# Altium schematic sheet MCU.SchDoc
size A4
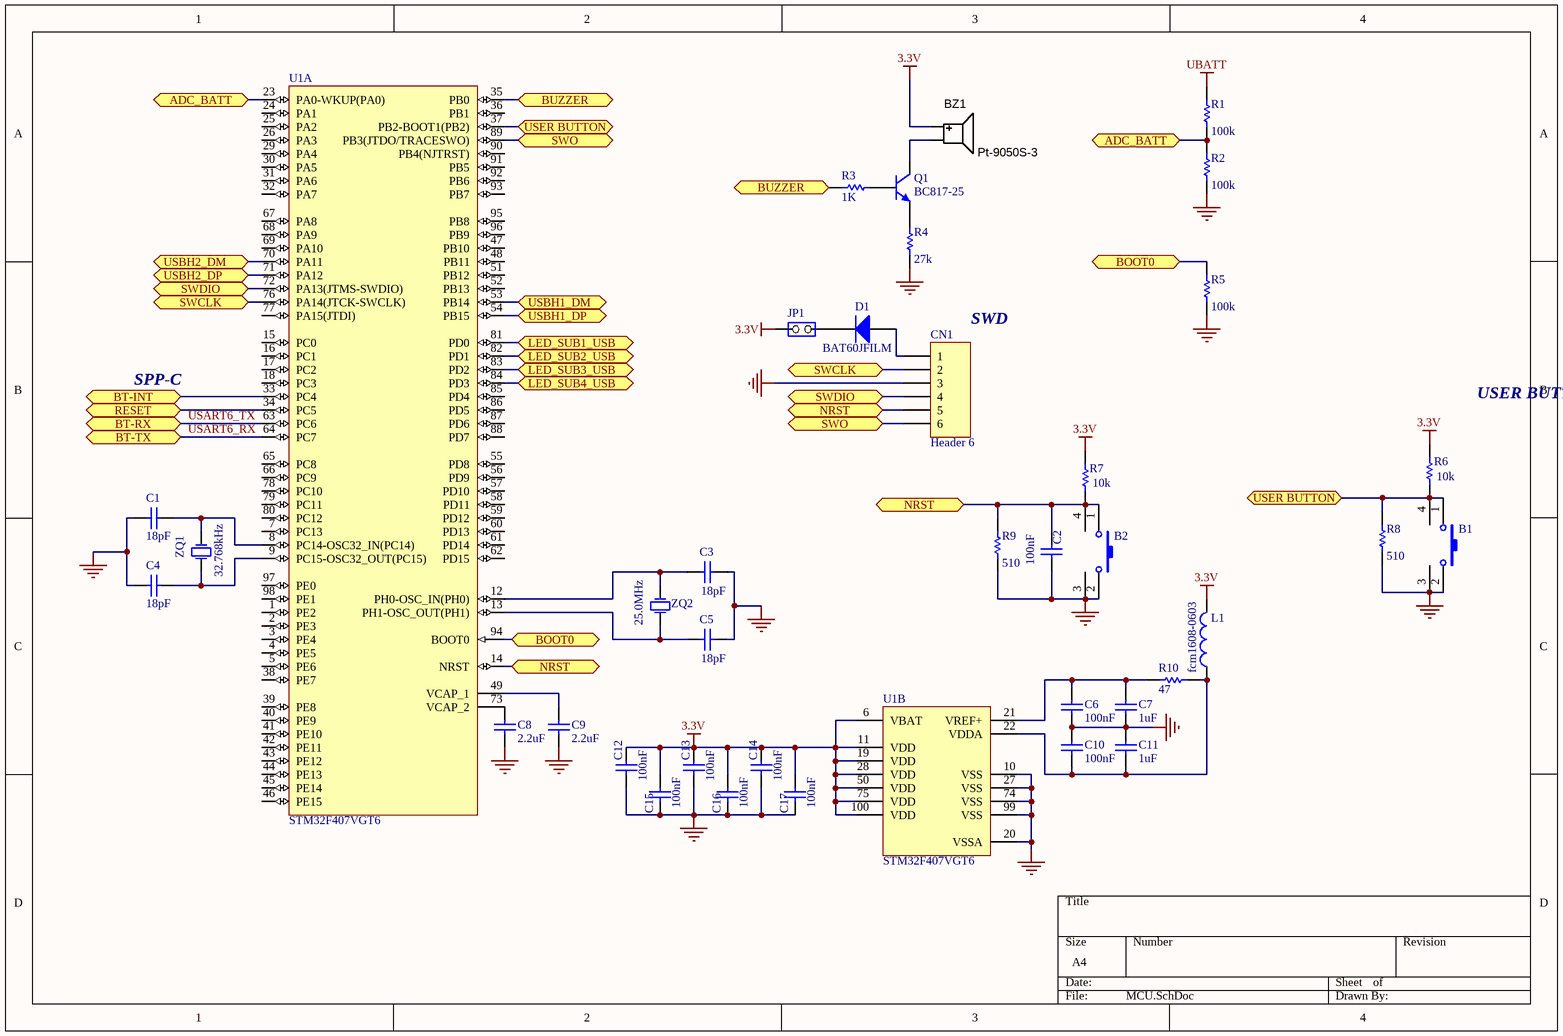
[diagram p0: MCU.SchDoc]

## Parts
B1  SW-PB  [SPST-2]  (value not drawn)
B2  SW-PB  [SPST-2]  (value not drawn)
BZ1  Pt-9050S-3  [BUZZER_12.0X8.5MM]
C1  value 18pF  [RAD-0.3]  (hidden comment: Cap)
C2  value 100nF  [RAD-0.3]  (hidden comment: Cap)
C3  value 18pF  [RAD-0.3]  (hidden comment: Cap)
C4  value 18pF  [RAD-0.3]  (hidden comment: Cap)
C5  value 18pF  [RAD-0.3]  (hidden comment: Cap)
C6  value 100nF  [RAD-0.3]  (hidden comment: Cap)
C7  value 1uF  [RAD-0.3]  (hidden comment: Cap)
C8  value 2.2uF  [RAD-0.3]  (hidden comment: Cap)
C9  value 2.2uF  [RAD-0.3]  (hidden comment: Cap)
C10  value 100nF  [RAD-0.3]  (hidden comment: Cap)
C11  value 1uF  [RAD-0.3]  (hidden comment: Cap)
C12  value 100nF  [RAD-0.3]  (hidden comment: Cap)
C13  value 100nF  [RAD-0.3]  (hidden comment: Cap)
C14  value 100nF  [RAD-0.3]  (hidden comment: Cap)
C15  value 100nF  [RAD-0.3]  (hidden comment: Cap)
C16  value 100nF  [RAD-0.3]  (hidden comment: Cap)
C17  value 100nF  [RAD-0.3]  (hidden comment: Cap)
CN1  Header 6  [HDR1X6]
D1  BAT60JFILM  [SOD323/A]
JP1  (no value)  [SIP2/2.54]
L1  value fcm1608-0603  [0402-A]  (hidden comment: Inductor)
Q1  BC817-25  [TO-226-AA]
R1  value 100k  [AXIAL-0.3]  (hidden comment: Res1)
R2  value 100k  [AXIAL-0.3]  (hidden comment: Res1)
R3  value 1K  [AXIAL-0.3]  (hidden comment: Res1)
R4  value 27k  [AXIAL-0.3]  (hidden comment: Res1)
R5  value 100k  [AXIAL-0.3]  (hidden comment: Res1)
R6  value 10k  [AXIAL-0.3]  (hidden comment: Res1)
R7  value 10k  [AXIAL-0.3]  (hidden comment: Res1)
R8  value 510  [AXIAL-0.3]  (hidden comment: Res1)
R9  value 510  [AXIAL-0.3]  (hidden comment: Res1)
R10  value 47  [AXIAL-0.3]  (hidden comment: Res1)
U1  STM32F407VGT6  [STM-LQFP100_N]  (parts A,B of 2)
ZQ1  value 32.768kHz  [R38]  (hidden comment: XTAL)
ZQ2  value 25.0MHz  [R38]  (hidden comment: XTAL)

## Ports
ADC_BATT (bidir), BOOT0 (bidir), BT-INT (bidir), BT-RX (bidir), BT-TX (bidir), BUZZER (bidir), LED_SUB1_USB (bidir), LED_SUB2_USB (bidir), LED_SUB3_USB (bidir), LED_SUB4_USB (bidir), NRST (bidir), RESET (bidir), SWCLK (bidir), SWDIO (bidir), SWO (bidir), USBH1_DM (bidir), USBH1_DP (bidir), USBH2_DM (bidir), USBH2_DP (bidir), USER BUTTON (bidir)

## Nets
3.3V: BZ1.1(Positive) C12.1 C13.1 C14.1 C15.1 C16.1 C17.1 JP1.2(NO) L1.2 R6.2 R7.2 U1.6(VBAT) U1.11(VDD) U1.19(VDD) U1.28(VDD) U1.50(VDD) U1.75(VDD) U1.100(VDD)
GND: B1.2 B1.3 B2.2 B2.3 C1.2 C2.1 C3.2 C4.2 C5.2 C6.1 C7.1 C8.2 C9.2 C10.2 C11.2 C12.2 C13.2 C14.2 C15.2 C16.2 C17.2 CN1.3 R2.1 R4.1 R5.1 R8.1 R9.1 U1.10(VSS) U1.20(VSSA) U1.27(VSS) U1.74(VSS) U1.99(VSS)
UBATT: R1.2
ADC_BATT: R1.1 R2.2 U1.23(PA0-WKUP(PA0)) ; port ADC_BATT
BOOT0: R5.2 U1.94(BOOT0) ; port BOOT0
BT-INT: U1.33(PC4) ; port BT-INT
BUZZER: R3.2 U1.35(PB0) ; port BUZZER
LED_SUB1_USB: U1.81(PD0) ; port LED_SUB1_USB
LED_SUB2_USB: U1.82(PD1) ; port LED_SUB2_USB
LED_SUB3_USB: U1.83(PD2) ; port LED_SUB3_USB
LED_SUB4_USB: U1.84(PD3) ; port LED_SUB4_USB
NRST: B2.1 B2.4 C2.2 CN1.5 R7.1 R9.2 U1.14(NRST) ; port NRST
RESET: U1.34(PC5) ; port RESET
SWCLK: CN1.2 U1.76(PA14(JTCK-SWCLK)) ; port SWCLK
SWDIO: CN1.4 U1.72(PA13(JTMS-SWDIO)) ; port SWDIO
SWO: CN1.6 U1.89(PB3(JTDO/TRACESWO)) ; port SWO
USART6_RX: U1.64(PC7) ; port BT-TX
USART6_TX: U1.63(PC6) ; port BT-RX
USBH1_DM: U1.53(PB14) ; port USBH1_DM
USBH1_DP: U1.54(PB15) ; port USBH1_DP
USBH2_DM: U1.70(PA11) ; port USBH2_DM
USBH2_DP: U1.71(PA12) ; port USBH2_DP
USER BUTTON: B1.1 B1.4 R6.1 R8.2 U1.37(PB2-BOOT1(PB2)) ; port USER BUTTON
NetBZ1_2: BZ1.2(Negative) Q1.1(C)
NetC1_1: C1.1 U1.8(PC14-OSC32_IN(PC14)) ZQ1.2(OSC2)
NetC3_1: C3.1 U1.12(PH0-OSC_IN(PH0)) ZQ2.1(OSC1)
NetC4_1: C4.1 U1.9(PC15-OSC32_OUT(PC15)) ZQ1.1(OSC1)
NetC5_1: C5.1 U1.13(PH1-OSC_OUT(PH1)) ZQ2.2(OSC2)
NetC6_2: C6.2 C7.2 R10.2 U1.21(VREF+)
NetC8_1: C8.1 U1.73(VCAP_2)
NetC9_1: C9.1 U1.49(VCAP_1)
NetC10_1: C10.1 C11.1 L1.1 R10.1 U1.22(VDDA)
NetCN1_1: CN1.1 D1.1(A)
NetD1_2: D1.2(K) JP1.1(COMMON)
NetQ1_2: Q1.2(B) R3.1
NetQ1_3: Q1.3(E) R4.2

Not connected (* = marked no-connect by the designer): U1 1(PE2) 2(PE3) 3(PE4) 4(PE5) 5(PE6) 7(PC13) 15(PC0) 16(PC1) 17(PC2) 18(PC3) 24(PA1) 25(PA2) 26(PA3) 29(PA4) 30(PA5) 31(PA6) 32(PA7) 36(PB1) 38(PE7) 39(PE8) 40(PE9) 41(PE10) 42(PE11) 43(PE12) 44(PE13) 45(PE14) 46(PE15) 47(PB10) 48(PB11) 51(PB12) 52(PB13) 55(PD8) 56(PD9) 57(PD10) 58(PD11) 59(PD12) 60(PD13) 61(PD14) 62(PD15) 65(PC8) 66(PC9) 67(PA8) 68(PA9) 69(PA10) 77(PA15(JTDI)) 78(PC10) 79(PC11) 80(PC12) 85(PD4) 86(PD5) 87(PD6) 88(PD7) 90(PB4(NJTRST)) 91(PB5) 92(PB6) 93(PB7) 95(PB8) 96(PB9) 97(PE0) 98(PE1)

## Notes on the sheet
- SPP-C
- (near CN1) SWD
- USER BUTTON AND BOOT1

## Library data of the parts
B1 B2 = SW-PB: Switch; Published: 24-Mar-1999; LatestRevisionDate: 17-Jul-2002; LatestRevisionNote: Re-released for DXP Platform.; PackageReference: SPST-2; Publisher: Altium Limited; PackageDescription: Switch; 2 Leads
BZ1 = BZ_12x8.5x6.5_2kHz: Speaker, Magnetic Transducer; Manufacturer 1: CUI Inc; Manufacturer Part Number 1: CEM-1201(50); Ratings: 2048 ±200 Hz; SCDType: source; Package / Case: 6.5mm pitch; Material: Noryl SE1-J; Supplier 1: Digi-Key; Supplier Part Number 1: 102-1152-ND
C1-C17 = Cap: Capacitor; Published: 8-Jun-2000; LatestRevisionDate: 17-Jul-2002; LatestRevisionNote: Re-released for DXP Platform.; PackageReference: RAD-0.3; Publisher: Altium Limited; PackageDescription: Radial Cap, Thru-Hole; 2 Leads; 0.3 in Pin Spacing
CN1 = Header 6: Header, 6-Pin; LatestRevisionDate: 17-Jul-2002; LatestRevisionNote: Re-released for DXP Platform.; Publisher: Altium Limited
D1 = BAT60JFILM: Manuf_1: STM; Code - JEDEC: DO-214-AB; Provided: ST; Published: 8-Jun-2000; Revision: July-2002: Re-released for DXP Platform.; Publisher: Altium Limited; Order: BAT60JFILM; Manuf_Part_1: BAT60JFILM
JP1 = JP2
L1 = Inductor: Code_IEC: 1005; Published: 8-Jun-2000; LatestRevisionDate: 29-May-2009; LatestRevisionNote: IPC-7351 Footprint Added.; PackageReference: 0402-A; Publisher: Altium Limited; PackageDescription: Chip Inductor; Code_JEITA: 0402
Q1 = NPN: NPN Bipolar Transistor; Published: 8-Jun-2000; LatestRevisionDate: 17-Jul-2002; LatestRevisionNote: Re-released for DXP Platform.; PackageReference: TO-226-AA; Publisher: Altium Limited; PackageDescription: TO, Flat Index; 3 In-Line, Axial Leads; Body Dia. 4.8mm; Leads 0.55 x 0.51 mm (max); Code_JEDEC: TO-226-AA
R1-R10 = Res1: Resistor; Published: 8-Jun-2000; LatestRevisionDate: 17-Jul-2002; LatestRevisionNote: Re-released for DXP Platform.; PackageReference: AXIAL-0.3; Publisher: Altium Limited; PackageDescription: Axial Device, Thru-Hole; 2 Leads; 0.3 in Pin Spacing
U1 = STM32F407VGT6: ARM Cortex-M4 32-bit MCU+FPU, 210 DMIPS, 1024 kB Flash, 192 kB Internal RAM, 82 I/Os, 100-pin LQFP, -40 to 85 degC, Tray; Manufacturer: STMicroelectronics; D/A Converter: 2x12-bit; FLASH Size (Prog) (kB): 1024; I/Os (High Current): 82; Internal RAM Size (kB): 192; Operating Frequency(F) (Processor speed) (MHz): 168; Supply Voltage(Vcc) max (V): 3.6; Supply Voltage(Vcc) min (V): 1.8; DatasheetVersion: Rev. 4; PackageVersion: Rev. 1, 06/2013; PackageReference: LQFP100; PackageDescription: 100-Pin Low Profile Quad Flat Package, 14 x 14 mm Body, 0.5 mm Pitch; Supplier 1: Digi-Key; Supplier Part Number 1: 497-11605-ND; Supplier 2: Farnell; Supplier Part Number 2: 2064368; Supplier 3: Newark; Supplier Part Number 3: 73T2333; Supplier 4: Mouser; Supplier Part Number 4: 511-STM32F407VGT6; Core: ARM Cortex-M4; Packing: Tray; Mounting Technology: Surface Mount; PartNumber: STM32F407VGT6; ComponentLink1Description: Manufacturer URL; ComponentLink1URL: http://www.st.com/web/en/home.html; ComponentLink2Description: Datasheet; ComponentLink2URL: http://www.st.com/st-web-ui/static/active/en/resource/technical/document/datasheet/DM00037051.pdf; ComponentLink3Description: Package Specification; ComponentLink3URL: http://www.st.com/st-web-ui/static/active/en/resource/technical/document/data_brief/DM00071938.pdf
ZQ1 ZQ2 = XTAL: Crystal Oscillator; Published: 8-Jun-2000; LatestRevisionDate: 17-Jul-2002; LatestRevisionNote: Re-released for DXP Platform.; PackageReference: R38; Publisher: Altium Limited; PackageDescription: Crystal, Thru-Hole; 2 Leads; Body 3.1 x 8.2 mm (Dia.xH)